# Altium project delay_versao_do_datasheet.PrjPcb
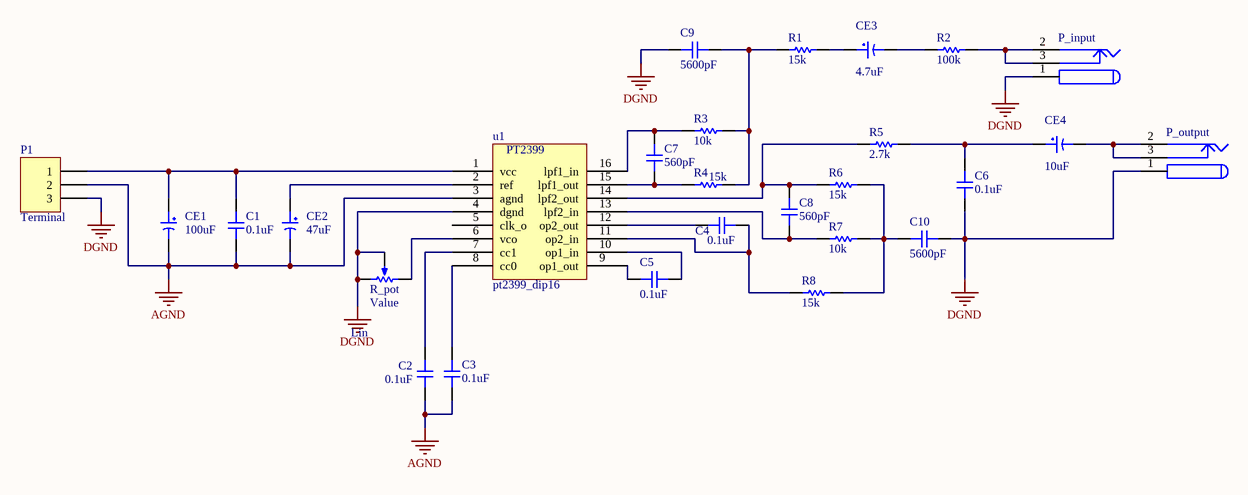
[diagram p0: mainSheet.SchDoc]
1 sheet, 27 parts. Net scope: global (net labels, ports and power ports of the same name join across sheets).
Board file: mainPCB.PcbDoc

## Sheet mainSheet.SchDoc
size A4

### Parts
C1  0.1uF  [C100-200-100]
C2  0.1uF  [C100-200-100]
C3  0.1uF  [C100-200-100]
C4  0.1uF  [C100-200-100]
C5  0.1uF  [C100-200-100]
C6  0.1uF  [C100-200-100]
C7  560pF  [C100-200-100]
C8  560pF  [C100-200-100]
C9  5600pF  [C400-550-150]
C10  5600pF  [C400-550-150]
CE1  100uF  [CP-RAD-5.0mm-15.0mm-2.0mm]
CE2  47uF  [PCBComponent_1]
CE3  4.7uF  [PCBComponent_1]
CE4  10uF  [PCBComponent_1]
P1  Terminal  [KRE_3]
P_input  Alim  [jack_p2_v1]  (value not drawn)
P_output  Alim  [jack_p2_v1]  (value not drawn)
R1  15k  [R400-2.0mm]
R2  100k  [R400-2.0mm]
R3  10k  [R400-2.0mm]
R4  15k  [R400-2.0mm]
R5  2.7k  [R400-2.0mm]
R6  15k  [R400-2.0mm]
R7  10k  [R400-2.0mm]
R8  15k  [R400-2.0mm]
R_pot  Value  Type: Lin  [POT]
u1  pt2399_dip16  [dip16]

### Nets
AGND: C1.1 C2.1 C3.1 CE1.2 CE2.2 P1.2 u1.3(agnd)
DGND: C6.2 C9.2 C10.2 P1.3 P_input.1 P_output.1 R_pot.2(TAP) R_pot.3(BOT) u1.4(dgnd)
NetC1_2: C1.2 CE1.1 P1.1 u1.1(vcc)
NetC2_2: C2.2 u1.7(cc1)
NetC3_2: C3.2 u1.8(cc0)
NetC4_1: C4.1 R8.1 u1.11(op2_in)
NetC4_2: C4.2 u1.12(op2_out)
NetC5_1: C5.1 u1.10(op1_in)
NetC5_2: C5.2 u1.9(op1_out)
NetC6_1: C6.1 CE4.1 R5.2
NetC7_1: C7.1 R4.1 u1.15(lpf1_out)
NetC7_2: C7.2 R3.1 u1.16(lpf1_in)
NetC8_1: C8.1 R7.1 u1.13(lpf2_in)
NetC8_2: C8.2 R5.1 R6.1 u1.14(lpf2_out)
NetC9_1: C9.1 R1.1 R3.2 R4.2
NetC10_1: C10.1 R6.2 R7.2 R8.2
NetCE2_1: CE2.1 u1.2(ref)
NetCE3_1: CE3.1 R1.2
NetCE3_2: CE3.2 R2.2
NetCE4_2: CE4.2 P_output.2 P_output.3
NetP_input_2: P_input.2 P_input.3 R2.1
NetR_pot_1: R_pot.1(TOP) u1.6(vco)

Not connected (* = marked no-connect by the designer): u1 5(clk_o)

### Notes on the sheet
- (in symbol pt2399_dip16) PT2399

### Library data of the parts
C1-C10 = Capacitor: Voltage: 100 V; Published: 8-Jun-2000; LatestRevisionDate: 17-Jul-2002; LatestRevisionNote: Re-released for DXP Platform.; PackageReference: RAD-0.3; Publisher: Altium Limited
CE1-CE4 = Capacitor-Electrolytic: Electrolytic Capacitor; Voltage: 25 V
P1 = KRE_3: Terminal Block 1x3
P_input P_output = Jack_J4: Jack J4
R1-R8 = Resistor: Tolerance: 5%; Power: 1/4 W; Published: 8-Jun-2000; LatestRevisionDate: 17-Jul-2002; LatestRevisionNote: Re-released for DXP Platform.; PackageReference: AXIAL-0.3; Publisher: Altium Limited
R_pot = Potentiometer